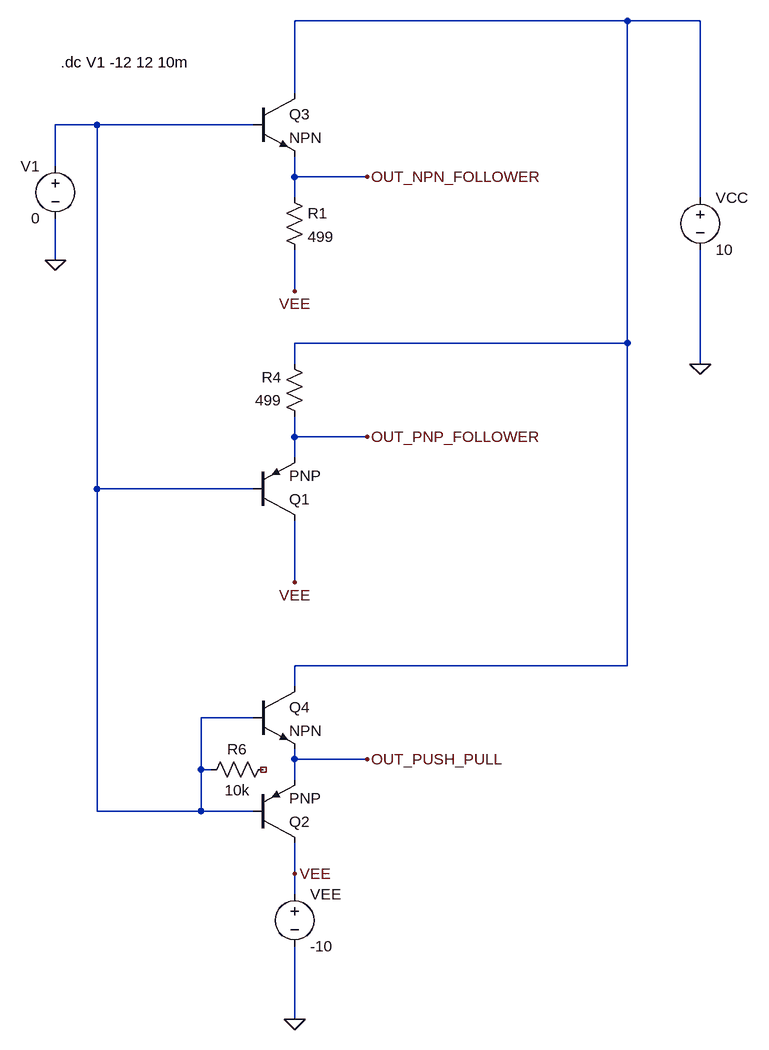
[diagram p0: schematic Push_Pull_Stage.asc]
Push_Pull_Stage.asc, the LTspice schematic file:
Version 4
SHEET 1 904 1524
WIRE 720 -32 208 -32
WIRE 832 -32 720 -32
WIRE 208 80 208 -32
WIRE -96 128 -160 128
WIRE 144 128 -96 128
WIRE -160 192 -160 128
WIRE 208 208 208 176
WIRE 320 208 208 208
WIRE 208 240 208 208
WIRE 832 240 832 -32
WIRE -160 336 -160 272
WIRE 208 384 208 320
WIRE 720 464 720 -32
WIRE 720 464 208 464
WIRE 208 496 208 464
WIRE 832 496 832 320
WIRE 208 608 208 576
WIRE 320 608 208 608
WIRE 208 640 208 608
WIRE -96 688 -96 128
WIRE 144 688 -96 688
WIRE 208 832 208 736
WIRE 720 960 720 464
WIRE 720 960 208 960
WIRE 208 992 208 960
WIRE 144 1040 64 1040
WIRE 208 1104 208 1088
WIRE 320 1104 208 1104
WIRE 64 1120 64 1040
WIRE 80 1120 64 1120
WIRE 208 1136 208 1104
WIRE -96 1184 -96 688
WIRE 64 1184 64 1120
WIRE 64 1184 -96 1184
WIRE 144 1184 64 1184
WIRE 208 1280 208 1232
WIRE 208 1312 208 1280
WIRE 208 1504 208 1392
FLAG -160 336 0
FLAG 832 496 0
FLAG 320 208 OUT_NPN_FOLLOWER
FLAG 320 608 OUT_PNP_FOLLOWER
FLAG 320 1104 OUT_PUSH_PULL
FLAG 208 1504 0
FLAG 208 1280 VEE
FLAG 208 832 VEE
FLAG 208 384 VEE
SYMBOL voltage -160 176 M0
WINDOW 123 0 0 Left 0
WINDOW 39 0 0 Left 0
SYMATTR InstName V1
SYMATTR Value 0
SYMBOL voltage 832 224 R0
WINDOW 123 0 0 Left 0
WINDOW 39 0 0 Left 0
SYMATTR InstName VCC
SYMATTR Value 10
SYMBOL res 192 224 R0
SYMATTR InstName R1
SYMATTR Value 499
SYMBOL res 224 592 R180
WINDOW 0 36 76 Left 2
WINDOW 3 36 40 Left 2
SYMATTR InstName R4
SYMATTR Value 499
SYMBOL res 176 1104 R90
WINDOW 0 0 56 VBottom 2
WINDOW 3 32 56 VTop 2
SYMATTR InstName R6
SYMATTR Value 10k
SYMBOL pnp 144 736 M180
SYMATTR InstName Q1
SYMBOL pnp 144 1232 M180
SYMATTR InstName Q2
SYMBOL npn 144 80 R0
SYMATTR InstName Q3
SYMBOL npn 144 992 R0
SYMATTR InstName Q4
SYMBOL voltage 208 1296 R0
WINDOW 123 0 0 Left 0
WINDOW 39 0 0 Left 0
SYMATTR InstName VEE
SYMATTR Value -10
TEXT -152 32 Left 2 !.dc V1 -12 12 10m

The netlist it stands for:
* Push_Pull_Stage.asc
V1 N002 0 0
VCC N001 0 10
R1 OUT_NPN_FOLLOWER VEE 499
R4 OUT_PNP_FOLLOWER N001 499
R6 NC_01 N002 10k
Q1 VEE N002 OUT_PNP_FOLLOWER 0 PNP
Q2 VEE N002 OUT_PUSH_PULL 0 PNP
Q3 N001 N002 OUT_NPN_FOLLOWER 0 NPN
Q4 N001 N002 OUT_PUSH_PULL 0 NPN
VEE VEE 0 -10
.model NPN NPN
.model PNP PNP
.lib standard.bjt
.dc V1 -12 12 10m
.backanno
.end